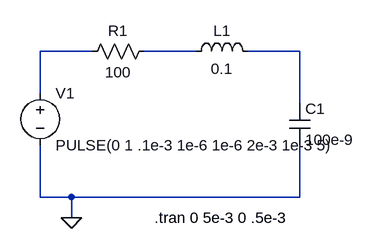
[diagram p0: schematic Series_RLC.asc]
Series_RLC.asc, the LTspice schematic file:
Version 4
SHEET 1 880 680
WIRE 0 -208 -80 -208
WIRE 160 -208 80 -208
WIRE 320 -208 240 -208
WIRE -80 -144 -80 -208
WIRE 320 -128 320 -208
WIRE -80 16 -80 -64
WIRE -32 16 -80 16
WIRE 320 16 320 -64
WIRE 320 16 -32 16
WIRE -32 48 -32 16
FLAG -32 48 0
SYMBOL voltage -80 -160 R0
WINDOW 123 24 44 Left 2
WINDOW 39 0 0 Left 2
SYMATTR InstName V1
SYMATTR Value PULSE(0 1 .1e-3 1e-6 1e-6 2e-3 1e-3 5)
SYMBOL ind 144 -192 R270
WINDOW 0 32 56 VTop 2
WINDOW 3 5 56 VBottom 2
SYMATTR InstName L1
SYMATTR Value 0.1
SYMBOL res 96 -224 R90
WINDOW 0 0 56 VBottom 2
WINDOW 3 32 56 VTop 2
SYMATTR InstName R1
SYMATTR Value 100
SYMBOL cap 304 -128 R0
SYMATTR InstName C1
SYMATTR Value 100e-9
TEXT 96 48 Left 2 !.tran 0 5e-3 0 .5e-3

The netlist it stands for:
* Series_RLC.asc
V1 N001 0 PULSE(0 1 .1e-3 1e-6 1e-6 2e-3 1e-3 5)
L1 N002 N003 0.1
R1 N002 N001 100
C1 N003 0 100e-9
.tran 0 5e-3 0 .5e-3
.backanno
.end